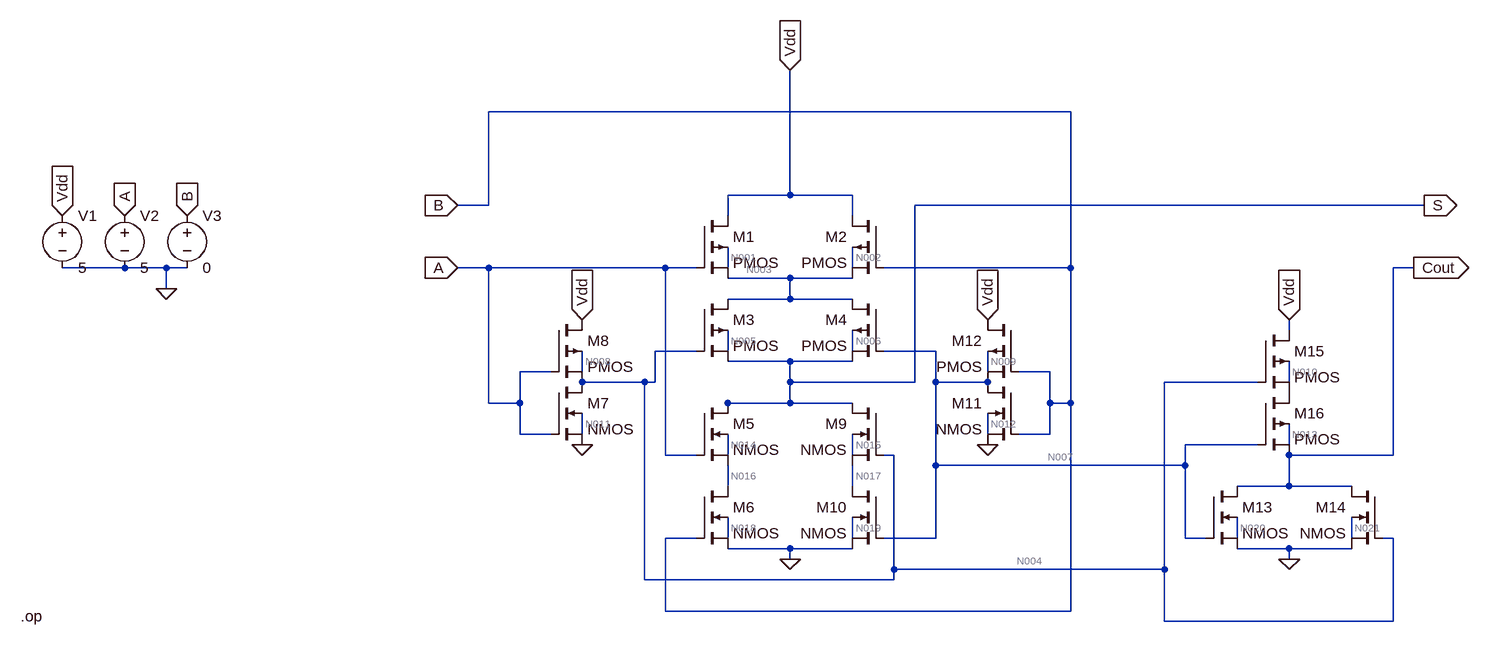
[diagram p0: schematic half_adder.asc]
half_adder.asc, the LTspice schematic file:
Version 4.1
SHEET 1 1440 680
WIRE 720 -112 -176 -112
WIRE 288 16 288 -176
WIRE 288 16 192 16
WIRE 384 16 288 16
WIRE -176 32 -176 -112
WIRE -176 32 -224 32
WIRE 1264 32 480 32
WIRE 192 48 192 16
WIRE 384 48 384 16
WIRE -736 128 -832 128
WIRE -672 128 -736 128
WIRE -640 128 -672 128
WIRE -176 128 -224 128
WIRE 96 128 -176 128
WIRE 144 128 96 128
WIRE 192 128 192 96
WIRE 384 128 384 96
WIRE 720 128 720 -112
WIRE 720 128 432 128
WIRE 1248 128 1216 128
WIRE 288 144 192 144
WIRE 384 144 288 144
WIRE -672 160 -672 128
WIRE 288 176 288 144
WIRE 288 176 192 176
WIRE 384 176 288 176
WIRE 1056 224 1056 208
WIRE 144 256 80 256
WIRE 192 256 192 224
WIRE 384 256 384 224
WIRE 512 256 432 256
WIRE 288 272 192 272
WIRE 384 272 288 272
WIRE -80 288 -128 288
WIRE -32 288 -32 256
WIRE 592 288 592 256
WIRE 688 288 640 288
WIRE 64 304 -32 304
WIRE 80 304 80 256
WIRE 80 304 64 304
WIRE 288 304 288 272
WIRE 480 304 480 32
WIRE 480 304 288 304
WIRE 512 304 512 256
WIRE 592 304 512 304
WIRE 1008 304 864 304
WIRE 1056 304 1056 272
WIRE -176 336 -176 128
WIRE -128 336 -128 288
WIRE -128 336 -176 336
WIRE 288 336 288 304
WIRE 288 336 192 336
WIRE 384 336 288 336
WIRE 688 336 688 288
WIRE 720 336 720 128
WIRE 720 336 688 336
WIRE 192 352 192 336
WIRE -128 384 -128 336
WIRE -80 384 -128 384
WIRE -32 384 -32 352
WIRE 592 384 592 352
WIRE 688 384 688 336
WIRE 688 384 640 384
WIRE 1008 400 896 400
WIRE 1056 400 1056 368
WIRE 96 416 96 128
WIRE 144 416 96 416
WIRE 192 416 192 384
WIRE 384 416 384 384
WIRE 448 416 432 416
WIRE 1216 416 1216 128
WIRE 1216 416 1056 416
WIRE 512 432 512 304
WIRE 896 432 896 400
WIRE 896 432 512 432
WIRE 192 464 192 432
WIRE 384 464 384 432
WIRE 1056 464 1056 416
WIRE 1056 464 976 464
WIRE 1152 464 1056 464
WIRE 144 544 96 544
WIRE 192 544 192 512
WIRE 384 544 384 512
WIRE 512 544 512 432
WIRE 512 544 432 544
WIRE 896 544 896 432
WIRE 928 544 896 544
WIRE 976 544 976 512
WIRE 1152 544 1152 512
WIRE 1216 544 1200 544
WIRE 288 560 192 560
WIRE 384 560 288 560
WIRE 1056 560 976 560
WIRE 1152 560 1056 560
WIRE 288 576 288 560
WIRE 1056 576 1056 560
WIRE 448 592 448 416
WIRE 864 592 864 304
WIRE 864 592 448 592
WIRE 64 608 64 304
WIRE 448 608 448 592
WIRE 448 608 64 608
WIRE 96 656 96 544
WIRE 720 656 720 336
WIRE 720 656 96 656
WIRE 864 672 864 592
WIRE 1216 672 1216 544
WIRE 1216 672 864 672
FLAG 288 576 0
FLAG -32 400 0
FLAG -32 208 Vdd
IOPIN -32 208 In
FLAG 288 -176 Vdd
IOPIN 288 -176 In
FLAG -224 128 A
IOPIN -224 128 In
FLAG 592 400 0
FLAG 592 208 Vdd
IOPIN 592 208 In
FLAG -224 32 B
IOPIN -224 32 In
FLAG 1264 32 S
IOPIN 1264 32 Out
FLAG -736 48 A
IOPIN -736 48 In
FLAG -640 48 B
IOPIN -640 48 In
FLAG -672 160 0
FLAG -832 48 Vdd
IOPIN -832 48 In
FLAG 1056 576 0
FLAG 1248 128 Cout
IOPIN 1248 128 Out
FLAG 1056 208 Vdd
IOPIN 1056 208 In
SYMBOL pmos4 144 48 R0
SYMATTR InstName M1
SYMBOL pmos4 432 48 M0
SYMATTR InstName M2
SYMBOL pmos4 144 176 R0
SYMATTR InstName M3
SYMBOL pmos4 432 176 M0
SYMATTR InstName M4
SYMBOL nmos4 144 336 R0
SYMATTR InstName M5
SYMBOL nmos4 144 464 R0
SYMATTR InstName M6
SYMBOL nmos4 -80 304 R0
SYMATTR InstName M7
SYMBOL pmos4 -80 208 R0
SYMATTR InstName M8
SYMBOL nmos4 432 336 M0
SYMATTR InstName M9
SYMBOL nmos4 432 464 M0
SYMATTR InstName M10
SYMBOL nmos4 640 304 M0
SYMATTR InstName M11
SYMBOL pmos4 640 208 M0
SYMATTR InstName M12
SYMBOL voltage -832 32 R0
WINDOW 123 0 0 Left 0
WINDOW 39 0 0 Left 0
SYMATTR InstName V1
SYMATTR Value 5
SYMBOL voltage -736 32 R0
WINDOW 123 0 0 Left 0
WINDOW 39 0 0 Left 0
SYMATTR InstName V2
SYMATTR Value 5
SYMBOL voltage -640 32 R0
WINDOW 123 0 0 Left 0
WINDOW 39 0 0 Left 0
SYMATTR InstName V3
SYMATTR Value 0
SYMBOL nmos4 928 464 R0
SYMATTR InstName M13
SYMBOL nmos4 1200 464 M0
SYMATTR InstName M14
SYMBOL pmos4 1008 224 R0
SYMATTR InstName M15
SYMBOL pmos4 1008 320 R0
SYMATTR InstName M16
TEXT -896 664 Left 2 !.op

The netlist it stands for:
* half_adder.asc
M1 Vdd A N003 N001 PMOS
M2 Vdd B N003 N002 PMOS
M3 N003 N004 S N005 PMOS
M4 N003 N007 S N006 PMOS
M5 S A N016 N014 NMOS
M6 N016 B 0 N018 NMOS
M7 N004 A 0 N011 NMOS
M8 Vdd A N004 N008 PMOS
M9 S N004 N017 N015 NMOS
M10 N017 N007 0 N019 NMOS
M11 N007 B 0 N012 NMOS
M12 Vdd B N007 N009 PMOS
V1 Vdd 0 5
V2 A 0 5
V3 B 0 0
M13 Cout N007 0 N020 NMOS
M14 Cout N004 0 N021 NMOS
M15 Vdd N004 P001 N010 PMOS
M16 P001 N007 Cout N013 PMOS
.model NMOS NMOS
.model PMOS PMOS
.lib standard.mos
.op
.backanno
.end

* Results of the author's LTspice run, read from the files saved beside the schematic
* Operating Point:
*   V(a) = 5 V
*   V(n001) = 4.859 V
*   V(b) = 0 V
*   V(n004) = 98.33 nV
*   V(n007) = 5 V
*   V(n016) = 4.999 V
*   V(n014) = 3.34 V
*   V(n011) = 36.13 nV
*   V(n015) = 158.3 mV
*   V(n012) = 158.3 mV
*   V(n020) = 36.13 nV
*   V(p001) = 5 V
*   V(n010) = 4.859 V
*   V(vdd) = 5 V
*   V(n003) = 5 V
*   V(n002) = 4.859 V
*   V(s) = 5 V
*   V(n005) = 4.859 V
*   V(n006) = 4.859 V
*   V(n018) = 158.3 mV
*   V(n008) = 4.823 V
*   V(n017) = 96.93 nV
*   V(n019) = 35.62 nV
*   V(n009) = 4.859 V
*   V(cout) = 98.33 nV
*   V(n021) = 36.13 nV
*   V(n013) = 4.823 V
*   Id(M1) = 2.43 pA
*   Ig(M1) = 0 A
*   Is(M1) = 2.43 pA
*   Ib(M1) = -4.859 pA
*   Id(M5) = 13.19 pA
*   Ig(M5) = 0 A
*   Is(M5) = -9.85 pA
*   Ib(M5) = -3.34 pA
*   Id(M6) = 9.85 pA
*   Ig(M6) = 0 A
*   Is(M6) = -9.691 pA
*   Ib(M6) = -158.3 fA
*   Id(M11) = 9.852 pA
*   Ig(M11) = 0 A
*   Is(M11) = -9.693 pA
*   Ib(M11) = -158.3 fA
*   I(V1) = -91.36 pA
*   Id(M13) = 9.833 pA
*   Ig(M13) = 0 A
*   Is(M13) = -9.833 pA
*   Ib(M13) = 0 A
*   Id(M3) = 30.33 pA
*   Ig(M3) = 0 A
*   Is(M3) = -25.47 pA
*   Ib(M3) = -4.859 pA
*   Id(M8) = 14.66 pA
*   Ig(M8) = 0 A
*   Is(M8) = -9.833 pA
*   Ib(M8) = -4.823 pA
*   I(V2) = 0 A
*   Id(M16) = 14.66 pA
*   Ig(M16) = 0 A
*   Is(M16) = -9.833 pA
*   Ib(M16) = -4.823 pA
*   Id(M4) = 2.43 pA
*   Ig(M4) = 0 A
*   Is(M4) = 2.43 pA
*   Ib(M4) = -4.859 pA
*   Id(M7) = 9.833 pA
*   Ig(M7) = 0 A
*   Is(M7) = -9.833 pA
*   Ib(M7) = 0 A
*   Id(M10) = 9.693 pA
*   Ig(M10) = 0 A
*   Is(M10) = -9.693 pA
*   Ib(M10) = 0 A
*   Id(M15) = 19.51 pA
*   Ig(M15) = 0 A
*   Is(M15) = -14.66 pA
*   Ib(M15) = -4.859 pA
*   Id(M2) = 40.05 pA
*   Ig(M2) = 0 A
*   Is(M2) = -35.19 pA
*   Ib(M2) = -4.859 pA
*   Id(M9) = 9.852 pA
*   Ig(M9) = 0 A
*   Is(M9) = -9.693 pA
*   Ib(M9) = -158.3 fA
*   Id(M12) = 14.71 pA
*   Ig(M12) = 0 A
*   Is(M12) = -9.852 pA
*   Ib(M12) = -4.859 pA
*   I(V3) = 0 A
*   Id(M14) = 0 A
*   Ig(M14) = 0 A
*   Is(M14) = 0 A
*   Ib(M14) = 0 A